# EAGLE design Tarjeta3 (EAGLE 7.6.0)
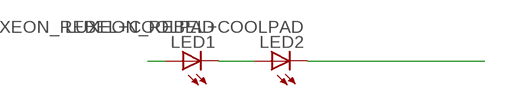
[diagram p0: schematic, sheet 1]

## Parts
LED1  LUXEON_REBEL+COOLPAD  [LUXEON_REBEL+COOLPAD]
LED2  LUXEON_REBEL+COOLPAD  [LUXEON_REBEL+COOLPAD]

## Nets
GND: LED2.C LED2.C@1(C)
N$10: LED1.C LED1.C@1(C) LED2.A LED2.A@1(A)
PWR: LED1.A LED1.A@1(A)

## Power pins joined to a net without a drawn wire
TH: LED1.TH LED1.TH@1(TH) LED1.TH@2(TH) LED1.TH@6(TH) LED1.TH@7(TH) LED1.TH@8(TH) LED1.TH@11(TH) LED1.TH@12(TH) LED1.TH@13(TH) LED1.TH@14(TH) LED1.TH@15(TH) LED1.TH@16(TH) LED1.TH@17(TH) LED1.TH@18(TH) LED1.TH@19(TH) LED1.TH@20(TH) LED1.TH@24(TH) LED1.TH@25(TH) LED1.TH@26(TH) LED1.TH@29(TH) LED1.TH@30(TH) LED1.TH@31(TH) LED1.TH@32(TH) LED1.TH@33(TH) LED1.TH@34(TH) LED1.TH@35(TH) LED2.TH LED2.TH@1(TH) LED2.TH@2(TH) LED2.TH@6(TH) LED2.TH@7(TH) LED2.TH@8(TH) LED2.TH@11(TH) LED2.TH@12(TH) LED2.TH@13(TH) LED2.TH@14(TH) LED2.TH@15(TH) LED2.TH@16(TH) LED2.TH@17(TH) LED2.TH@18(TH) LED2.TH@19(TH) LED2.TH@20(TH) LED2.TH@24(TH) LED2.TH@25(TH) LED2.TH@26(TH) LED2.TH@29(TH) LED2.TH@30(TH) LED2.TH@31(TH) LED2.TH@32(TH) LED2.TH@33(TH) LED2.TH@34(TH) LED2.TH@35(TH)

## Library data of the parts
LED1 LED2 = led-lumiled-redux:LUXEON_REBEL+COOLPAD: LUXEON REBEL LED with cooling pads Display Layer Refence in Board for more information Stop and Cream Mask defined by Luxeon Rebel Footprint _customer.dxf; OC_FARNELL: unknown; OC_NEWARK: unknown

## Board
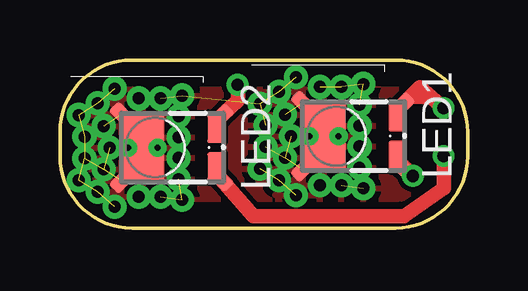
[diagram p1: board, top side]
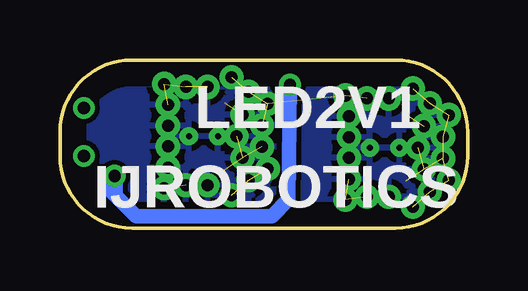
[diagram p2: board, bottom side, seen from below]

Size 17 x 7 mm. Coordinates in mm from the lower left corner, seen from the top.
Outline: 0,3 arc90 3,0 14,0 arc90 17,3 17,4 arc90 14,7 3,7 arc90 0,4 0,3
Copper layers (1*16): Top 0.035mm / dielectric 0.204mm / Bottom 0.035mm
Design rules "default *": minimum track width 10mil, minimum drill 24mil, track to track 8mil, track to pad 8mil, pad to pad 8mil, via to via 8mil, smd to smd 8mil, copper to edge 40mil, drill to drill 8mil, minimum pad ring 10mil, minimum via ring 8mil, stop-mask expansion 4mil, vias tented up to drill 0mil, thermal gap 10mil

### Footprints (pad centres in the part's own frame; a part is rotated, then mirrored left to right if it is on the bottom)
LUXEON_REBEL+COOLPAD = smd 1.2 x 0.67: A 0.8,-2.51; C -0.8,-2.51 | smd 1 x 0.6 rotated 315: A@1 1.31,-2.75 | smd 1 x 0.6 rotated 225: C@1 -1.31,-2.75 | smd 2.8 x 1.77: TH 0,0.51 | smd 1 x 0.6 rotated 135: TH@1 -1.39,1.39 | smd 1 x 0.6 rotated 45: TH@2 1.39,1.39 | drill 0.5 pad 0.6: TH@6 2.05,0.68; TH@7 2.05,-0.22; TH@8 2.171,-1.12; TH@11 2.461,1.687; TH@12 1.844,2.394; TH@13 0.9,2.15; TH@14 0,1.9; TH@15 0.45,2.95; TH@16 1.356,3.196; TH@17 1.31,-0.97; TH@18 0.43,-0.97; TH@24 -2.05,0.68; TH@25 -2.05,-0.22; TH@26 -2.171,-1.12; TH@29 -2.461,1.687; TH@30 -1.844,2.394; TH@31 -0.9,2.15; TH@32 -0.45,2.95; TH@33 -1.356,3.196; TH@34 -1.31,-0.97; TH@35 -0.43,-0.97 | drill 0.25 pad 0.4: TH@19 0,-0.095; TH@20 0,1.125

### Placement (x,y rotation side)
LED1  11.53,3.83 90 top
LED2  3.97,3.35 90 top

### Tracks (layer width: path | path; a pad name or v marks a point on that pad's centre or on a via)
GND  (via drill 0.51)
  Top 0.61: v16,3 16,1.67 14.34,0.49 8.07,0.49 LED2.C@1
N$1
  Top 0.61: 15.36,5.46 14.65,5.46 arc90 14.64,5.45
N$2
  Bottom 0.61: 14.68,1.36 14.68,2.13 arc-90 14.69,2.15
N$10  (via drill 0.51)
  Top 0.61: LED2.A@1 7.44,5.33 v7.41,5.97 | LED1.C@1 14.29,2.6 v14.72,2.17
  Bottom 0.61: v7.41,5.97 7.46,1.2 8.15,0.5 13.83,0.5 15.11,1.77 14.72,2.15 v14.72,2.17
PWR  (via drill 0.51)
  Top 0.152: LED1.A@1 14.15,5.08
  Top 0.61: v16,5 15.02,5.86 LED1.A@1
TH  (28 unrouted)
  pour Bottom (isolate 0.005): 0,4 arc-90 3,7 14,7 arc-90 17,4 17,3 arc-90 14,0 3,0 arc-90 0,3
  pour Top (isolate 0.005): 0,4 arc-90 3,7 14,7 arc-90 17,4 17,3 arc-90 14,0 3,0 arc-90 0,3

### Text on the board
bNames: LED2V1 | IJROBOTICS